# Altium schematic sheet Step-up converter.SchDoc
size A4; SheetNumber: 4; SheetTotal: 4
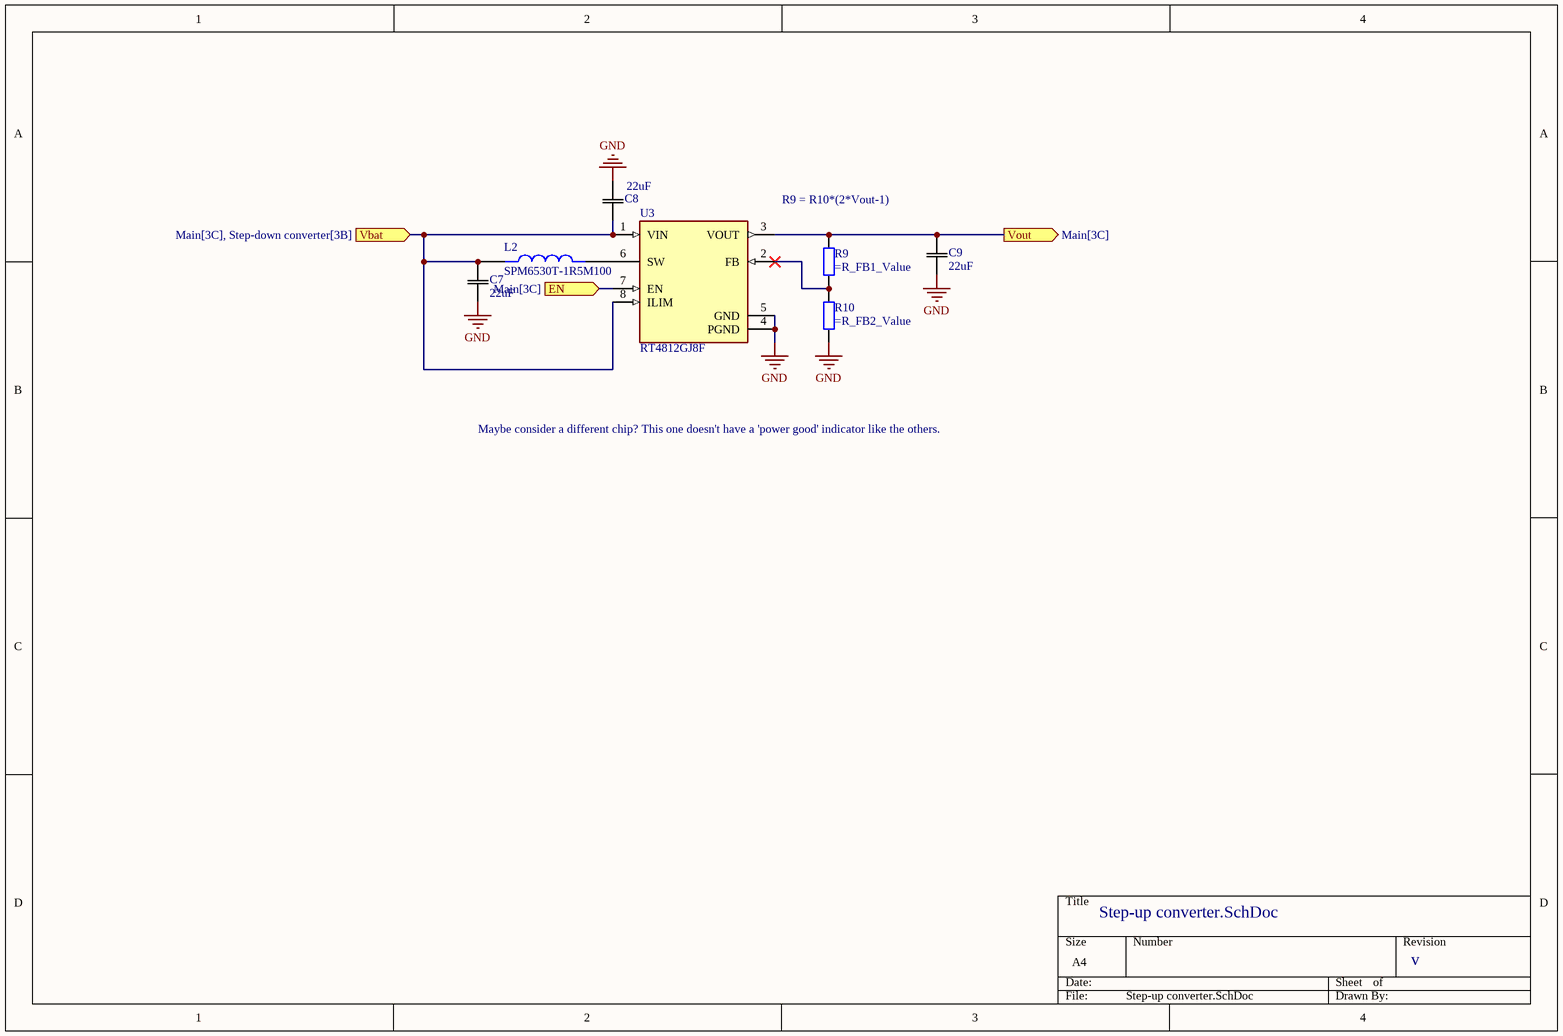
[diagram p0: Step-up converter.SchDoc]

## Parts
C7  22uF  [CAPC2012X94N]
C8  22uF  [CAPC2012X94N]
C9  22uF  [CAPC2012X94N]
L2  SPM6530T-1R5M100  [IND_SPM6530T-1R5M100]
R9  (no value)  [0805]
R10  (no value)  [0805]
U3  RT4812GJ8F  [SOT65P279X100-8N]

## Ports
EN (in, see Main[3C]), Vbat (in, see Main[3C], Step-down converter[3B]), Vout (out, see Main[3C])

## Nets
GND: C7.1 C8.2 C9.1 R10.1 U3.4(PGND) U3.5(GND)
EN: U3.7(EN) ; port EN
Vbat: C7.2 C8.1 L2.1 U3.1(VIN) U3.8(ILIM) ; port Vbat
Vout: C9.2 R9.2 U3.3(VOUT) ; port Vout
NetL2_2: L2.2 U3.6(SW)
NetR9_1: R9.1 R10.2 U3.2(FB)

## Notes on the sheet
- R9 = R10*(2*Vout-1)
- Maybe consider a different chip? This one doesn't have a 'power good' indicator like the others.
- v

## Library data of the parts
C7-C9 = CAP 0805: No Description Available; IsInLabBook: Yes; Value: 22uF
L2 = SPM6530T-1R5M100: 1.5 ÂµH Shielded Drum Core, Wirewound Inductor 11 A 10.67mOhm Max Nonstandard; MF: TDK; Value: *; Digi-Key_Part_Number: 445-3881-2-ND; Check_prices: https://www.snapeda.com/parts/SPM6530T-1R5M100/TDK/view-part/?ref=eda; Package: NON STANDARD-2 TDK; SnapEDA_Link: https://www.snapeda.com/parts/SPM6530T-1R5M100/TDK/view-part/?ref=snap; MP: SPM6530T-1R5M100; Purchase-URL: https://pricing.snapeda.com/search/part/SPM6530T-1R5M100/?ref=eda
R9 R10 = Res 0805: Resistor; IsInLabBook: Check; Value: =R_FB1_Value
U3 = RT4812GJ8F: Boost Switching Regulator IC Positive Adjustable 1.8V 1 Output 2A SOT-23-8 Thin, TSOT-23-8; MF: Richtek USA; Value: *; Availability: Unavailable; Price: None; SnapEDA_Link: https://www.snapeda.com/parts/RT4812GJ8F/Richtek%20USA%20Inc./view-part/699858/?ref=snap; DigiKey-Purchase-URL: https://snapeda.com/shop?store=DigiKey&id=699858; Package: TSOT-23 Richtek; MP: RT4812GJ8F